# Altium project CW308T_SI4010.PrjPcb
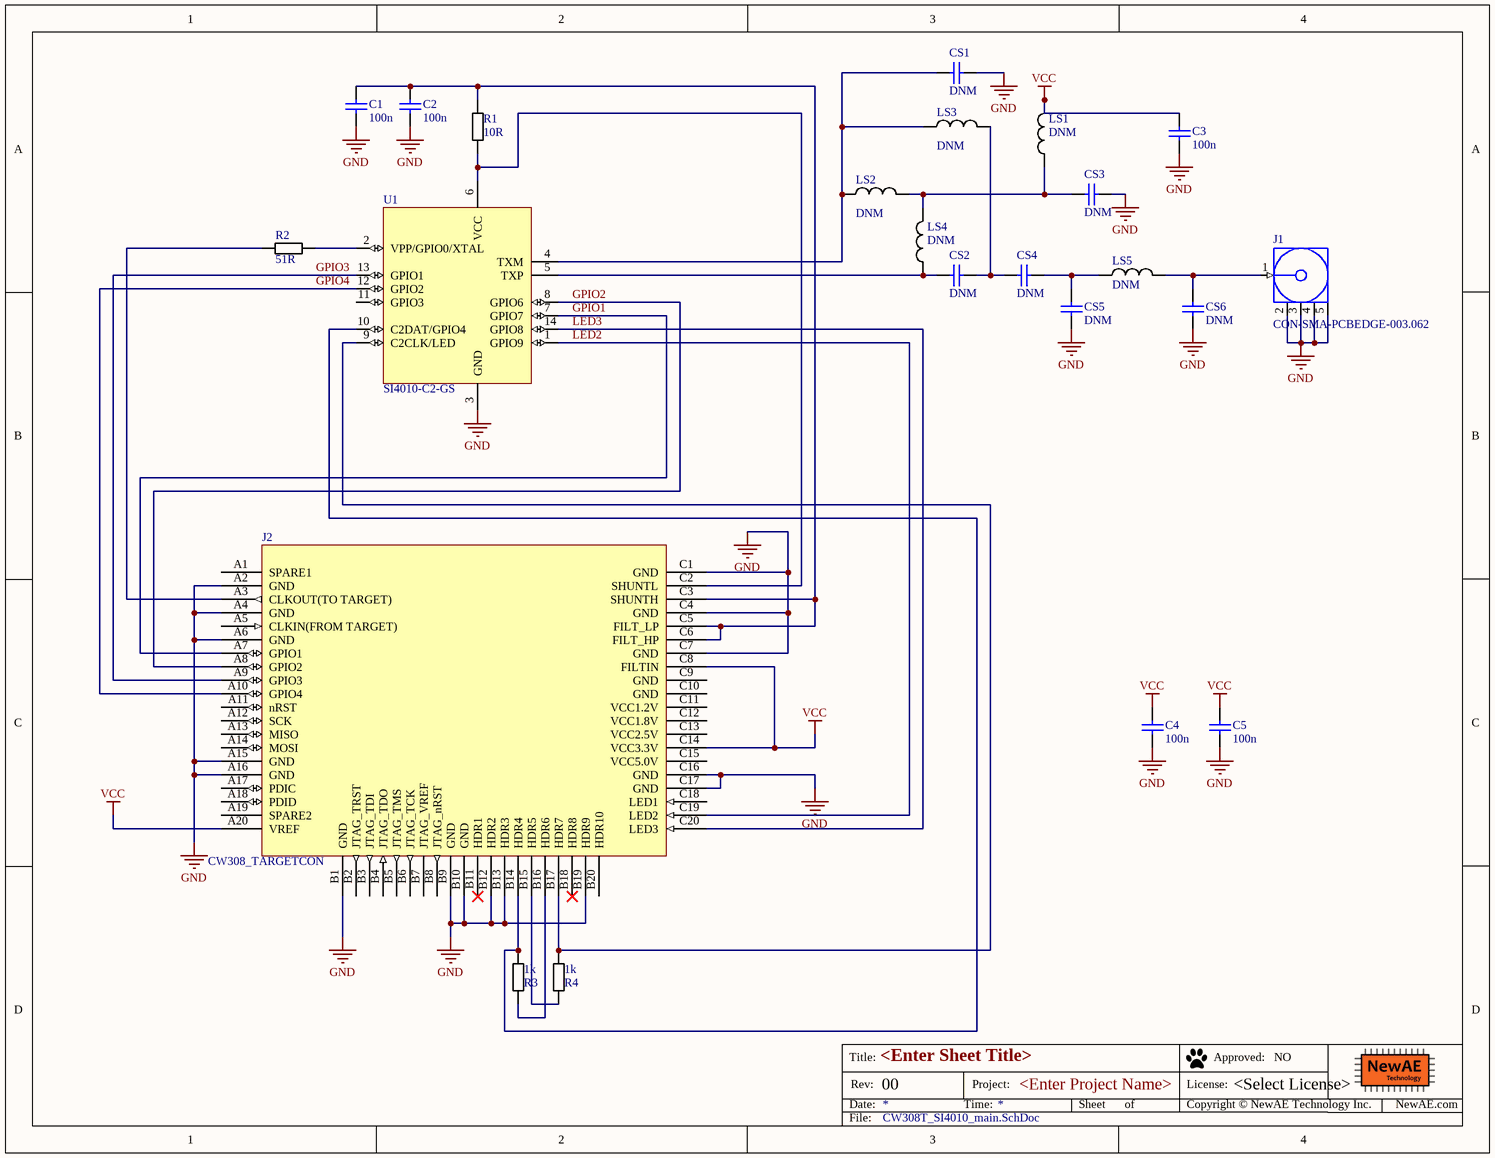
[diagram p0: CW308T_SI4010_main.SchDoc]
PrjLicense: <Select License>; PrjName: <Enter Project Name>; PrjRev: 00
1 sheet, 23 parts. Net scope: global (net labels, ports and power ports of the same name join across sheets).
Board file: CW308T_Si4010.PcbDoc

## Sheet CW308T_SI4010_main.SchDoc: <Enter Sheet Title>
size Letter; Organization: NewAE Technology Inc.; Address1: 1083 Queen St., Suite 196; Address2: Halifax; Address3: NS; Address4: Canada B3H 0B2; SheetApproved: NO

### Parts
C1  100n  [CAPC0603_M]
C2  100n  [CAPC0603_M]
C3  100n  [CAPC0603_M]
C4  100n  [CAPC0603_M]
C5  100n  [CAPC0603_M]
CS1  DNM  [CAPC0402_M]
CS2  DNM  [CAPC0402_M]
CS3  DNM  [CAPC0402_M]
CS4  DNM  [CAPC0402_M]
CS5  DNM  [CAPC0402_M]
CS6  DNM  [CAPC0402_M]
J1  CON-SMA-PCBEDGE-003.062  [CON-SMAM-PCB-EDGE062]
J2  CW308_TARGETCON  [CW308_TBOARD_CONN]
LS1  DNM  [RESC1005X40N]
LS2  DNM  [RESC1005X40N]
LS3  DNM  [RESC1005X40N]
LS4  DNM  [RESC1005X40N]
LS5  DNM  [RESC1005X40N]
R1  10R  [RESC1608X55N]
R2  51R  [RESC1608X55N]
R3  1k  [RESC1608X55N]
R4  1k  [RESC1608X55N]
U1  SI4010-C2-GS  [SOIC127P600X175-14M]

### Nets
GND: C1.1 C2.1 C3.1 C4.1 C5.1 CS1.2 CS3.2 CS5.2 CS6.2 J1.2(GND) J1.3(GND) J1.4(GND) J1.5(GND) J2.A2(GND) J2.A4(GND) J2.A6(GND) J2.A15(GND) J2.A16(GND) J2.B1(GND) J2.B9(GND) J2.B10(GND) J2.B12(HDR2) J2.B13(HDR3) J2.B19(HDR9) J2.C1(GND) J2.C4(GND) J2.C7(GND) J2.C16(GND) J2.C17(GND) U1.3(GND)
VCC: C3.2 C4.2 C5.2 J2.A20(VREF) J2.C8(FILTIN) J2.C14(VCC3.3V) LS1.2
GPIO1: J2.A7(GPIO1) U1.7(GPIO7)
GPIO2: J2.A8(GPIO2) U1.8(GPIO6)
GPIO3: J2.A9(GPIO3) U1.13(GPIO1)
GPIO4: J2.A10(GPIO4) U1.12(GPIO2)
LED2: J2.C19(LED2) U1.1(GPIO9)
LED3: J2.C20(LED3) U1.14(GPIO8)
NetC1_2: C1.2 C2.2 J2.C3(SHUNTH) J2.C5(FILT_LP) J2.C6(FILT_HP) R1.1
NetCS1_1: CS1.1 LS2.1 LS3.1 U1.4(TXM)
NetCS2_1: CS2.1 LS4.1 U1.5(TXP)
NetCS2_2: CS2.2 CS4.1 LS3.2
NetCS3_1: CS3.1 LS1.1 LS2.2 LS4.2
NetCS4_2: CS4.2 CS5.1 LS5.1
NetCS6_1: CS6.1 J1.1(Signal) LS5.2
NetJ2_A3: J2.A3(CLKOUT(TO_TARGET)) R2.1
NetJ2_B14: J2.B14(HDR4) R3.1 U1.10(C2DAT/GPIO4)
NetJ2_B15: J2.B15(HDR5) R4.2
NetJ2_B16: J2.B16(HDR6) R3.2
NetJ2_B17: J2.B17(HDR7) R4.1 U1.9(C2CLK/LED)
NetJ2_C2: J2.C2(SHUNTL) R1.2 U1.6(VCC)
NetR2_2: R2.2 U1.2(VPP/GPIO0/XTAL)

Not connected (* = marked no-connect by the designer): J2 A1(SPARE1) A5(CLKIN(FROM_TARGET)) A11(nRST) A12(SCK) A13(MISO) A14(MOSI) A17(PDIC) A18(PDID) A19(SPARE2) B2(JTAG_TRST) B3(JTAG_TDI) B4(JTAG_TDO) B5(JTAG_TMS) B6(JTAG_TCK) B7(JTAG_VREF) B8(JTAG_nRST) B11(HDR1)* B18(HDR8)* B20(HDR10) C9(GND) C10(GND) C11(VCC1.2V) C12(VCC1.8V) C13(VCC2.5V) C15(VCC5.0V) C18(LED1); U1 11(GPIO3)

### Notes on the sheet
- Title:
- Date:
- Rev:
- Time:
- Project:
- Sheet
- of
- License:
- Copyright © NewAE Technology Inc.
- Approved:
- NewAE.com
- File:

### Library data of the parts
C1-C5 = CCHIP-100n-0603: 100n, 0603; Component Group: Capacitor; Case-EIA: 0603; Case-Metric: 1608; Part Number: CCHIP-100n-0603; Footprint: 0603; Pin Count: 2; Value: 100n; Mounting Technology: SMT; Component Kind: Standard; Component Type: Standard
CS1-CS6 = CCHIP-DNM-0402: DNM, 0402; Component Group: Capacitor; Case-EIA: 0402; Part Number: CCHIP-DNM-0402; Footprint: 0402; Pin Count: 2; Value: DNM; Mounting Technology: SMT; Component Kind: Standard; Component Type: Standard
J1 = CON-SMA-PCBEDGE-003.062: SMA Female Edge Mount Connector for 0.062" Thick Board; PCB_Layout: Pads complies with manufacturer's recommendation.; DatasheetVersion: rev1.0, Aug-2006; PackageVersion: rev1.0, Aug-2006; PackageReference: CON-SMA-EDGE062; PackageDescription: SMA Female Edge Mount Connector for 0.062" Thick Board, 7.9 mm Body Dia.; ComponentLink1Description: Manufacturer URL; ComponentLink1URL: http://www.linxtechnologies.com/; ComponentLink2Description: Datasheet; ComponentLink2URL: http://www.connectorcity.com/diagrams/SMA/CONSMA003.062.pdf; Part Number: CON-SMA-PCBEDGE-003.062; Component Group: Connector; Pin Count: 5; Component Kind: Standard; Component Type: Standard
J2 = CW308_TBOARD: CW308 "Standard" Target Board Connector; Pitch: 2.54mm; Part Number: CW308_TBOARD; Component Kind: Standard; Component Type: Standard; Pin Count: 60; Mounting Technology: Through-hole
LS1-LS5 = LCHIP-DNM-0402: DNM, 0402; Component Group: Inductor; Case-EIA: 0402; Part Number: LCHIP-DNM-0402; Footprint: 0402; Pin Count: 2; Value: DNM; Mounting Technology: SMT; Component Kind: Standard; Component Type: Standard
R1 = RCHIP-10R-0603: 10R res, 0603, 1%, 1/10W; Manufacture 1: Yageo; Manufacture Part Number 1: RC0603FR-0710RL; Component Group: Resistor; Case-EIA: 0603; Case-Metric: 1608; Rated Power: 0.1W; Rated Voltage: 75VDC; Part Number: RCHIP-10R-0603; Footprint: 0603; Pin Count: 2; Supplier 1: Digi-Key; Supplier Part Number 1: 311-10.0HRCT-ND; Value: 10R; Tolerance: 1%; Mounting Technology: SMT; Temperature Range: -55C to 155C; Component Kind: Standard; Component Type: Standard
R2 = RCHIP-51R-0603: 51R res, 0603, 1%, 1/10W; Manufacture 1: Yageo; Manufacture Part Number 1: RC0603FR-0751RL; Component Group: Resistor; Case-EIA: 0603; Case-Metric: 1608; Rated Power: 0.1W; Rated Voltage: 75VDC; Part Number: RCHIP-51R-0603; Footprint: 0603; Pin Count: 2; Supplier 1: Digi-Key; Supplier Part Number 1: 311-51.0HRCT-ND; Value: 51R; Tolerance: 1%; Mounting Technology: SMT; Temperature Range: -55C to 155C; Component Kind: Standard; Component Type: Standard
R3 R4 = RCHIP-1K-0603: 1k res, 0603, 1%, 1/10W; Manufacture 1: Yageo; Manufacture Part Number 1: RC0603FR-071KL; Case-EIA: 0603; Case-Metric: 1608; Rated Power: 0.1W; Rated Voltage: 75VDC; Part Number: RCHIP-1K-0603; Component Kind: Standard; Component Type: Standard; Footprint: 0603; Pin Count: 2; Supplier 1: Digi-Key; Supplier Part Number 1: 311-1.00KHRCT-ND; Value: 1k; Tolerance: 1%; Mounting Technology: SMT; Temperature Range: -55C to 155C
U1 = Si4010-GS: RF Transmitter FSK, OOK 27MHz ~ 960MHz, HW-AES; Manufacture 1: Silicon Labs; Part Number: Si4010-GS; Component Kind: Standard; Component Type: Standard; Footprint: SOIC14; Manufacture Part Number 1: SI4010-C2-GS; Pin Count: 14; Supplier 1: Digi-Key; Supplier Part Number 1: 336-1996-5-ND; Mounting Technology: SMT